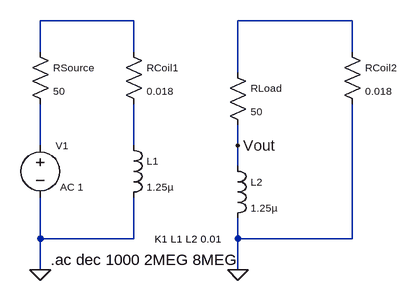
[diagram p0: schematic 2-coil_non-resonant.asc]
2-coil_non-resonant.asc, the LTspice schematic file:
Version 4.1
SHEET 1 880 680
WIRE 192 80 48 80
WIRE 528 80 352 80
WIRE 48 128 48 80
WIRE 192 128 192 80
WIRE 528 128 528 80
WIRE 352 160 352 80
WIRE 48 272 48 208
WIRE 192 272 192 208
WIRE 352 272 352 240
WIRE 352 304 352 272
WIRE 48 416 48 352
WIRE 192 416 192 352
WIRE 192 416 48 416
WIRE 352 416 352 384
WIRE 528 416 528 208
WIRE 528 416 352 416
WIRE 48 464 48 416
WIRE 352 464 352 416
FLAG 48 464 0
FLAG 352 464 0
FLAG 352 272 Vout
SYMBOL res 32 112 R0
WINDOW 0 36 40 Left 1
WINDOW 3 36 76 Left 1
SYMATTR InstName RSource
SYMATTR Value 50
SYMBOL res 336 144 R0
WINDOW 0 36 40 Left 1
WINDOW 3 36 76 Left 1
SYMATTR InstName RLoad
SYMATTR Value 50
SYMBOL ind 176 256 R0
WINDOW 0 36 40 Left 1
WINDOW 3 36 80 Left 1
SYMATTR InstName L1
SYMATTR Value 1.25µ
SYMATTR Type ind
SYMATTR SpiceLine Rser=1m
SYMBOL ind 336 288 R0
WINDOW 0 36 40 Left 1
WINDOW 3 36 80 Left 1
SYMATTR InstName L2
SYMATTR Value 1.25µ
SYMATTR Type ind
SYMATTR SpiceLine Rser=1m
SYMBOL voltage 48 256 R0
WINDOW 123 31 80 Left 1
WINDOW 39 0 0 Left 0
WINDOW 0 24 16 Left 1
SYMATTR Value2 AC 1
SYMATTR InstName V1
SYMATTR Value ""
SYMBOL res 176 112 R0
WINDOW 0 36 40 Left 1
WINDOW 3 36 76 Left 1
SYMATTR InstName RCoil1
SYMATTR Value 0.018
SYMBOL res 512 112 R0
WINDOW 0 36 40 Left 1
WINDOW 3 36 76 Left 1
SYMATTR InstName RCoil2
SYMATTR Value 0.018
TEXT 224 416 Left 1 !K1 L1 L2 0.01
TEXT 64 448 Left 2 !.ac dec 1000 2MEG 8MEG

The netlist it stands for:
* 2-coil_non-resonant.asc
RSource N001 N003 50
RLoad N002 Vout 50
L1 N004 0 1.25µ Rser=1m
L2 Vout 0 1.25µ Rser=1m
V1 N003 0 AC 1
RCoil1 N001 N004 0.018
RCoil2 N002 0 0.018
K1 L1 L2 0.01
.ac dec 1000 2MEG 8MEG
.backanno
.end